# EAGLE schematic COSEQ_shield (EAGLE 6.5.0)
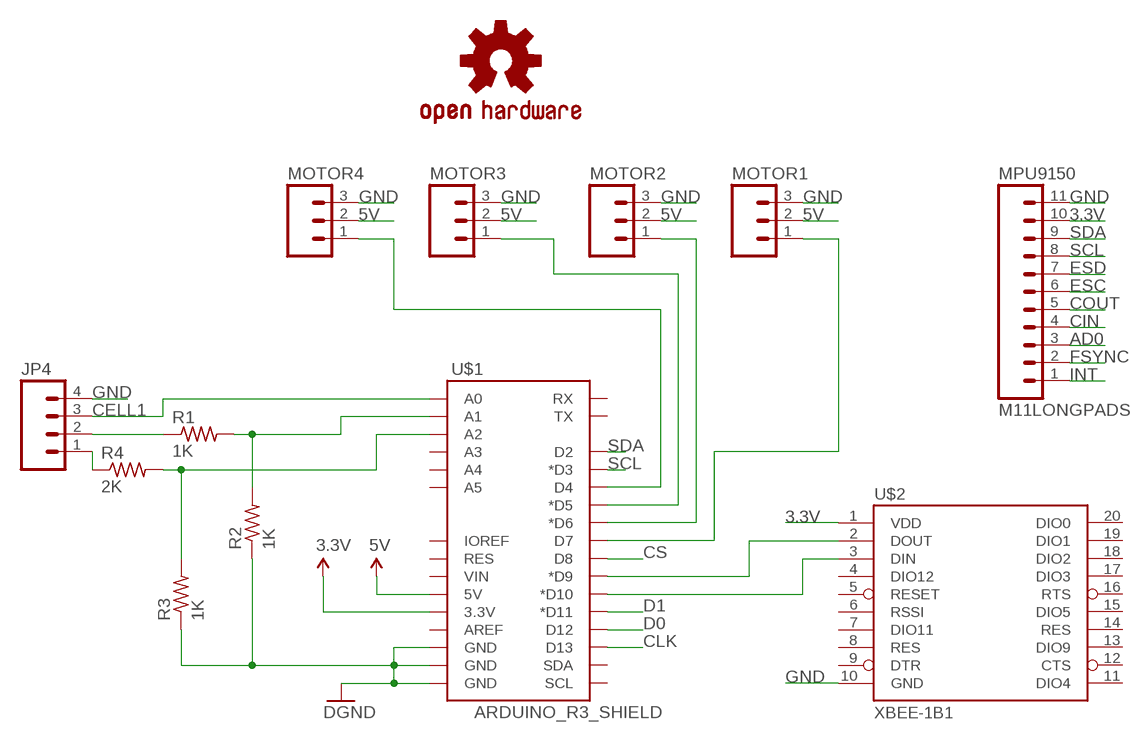
[diagram p0: schematic, sheet 1]

## Parts
JP4  M04LONGPADS  [1X04_LONGPADS]
LOGO1  OSHW-LOGOL  [OSHW-LOGO-L]
MOTOR1  M03LONGPADS  [1X03_LONGPADS]
MOTOR2  M03LONGPADS  [1X03_LONGPADS]
MOTOR3  M03LONGPADS  [1X03_LONGPADS]
MOTOR4  M03LONGPADS  [1X03_LONGPADS]
MPU9150  M11LONGPADS  [1X11_LONGPADS]
R1  1K  RESISTOR1/6WATT  [RESISTOR]
R2  1K  RESISTOR1/6WATT  [RESISTOR]
R3  1K  RESISTOR1/6WATT  [RESISTOR]
R4  2K  RESISTOR1/6WATT  [RESISTOR]
U$1  ARDUINO_R3_SHIELD  [UNO_R3_SHIELD]
U$2  XBEE-1B1  [XBEE-1]

## Nets
3.3V: MPU9150.10 U$1.3.3V U$2.1(VDD)
5V: MOTOR1.2 MOTOR2.2 MOTOR3.2 MOTOR4.2 U$1.5V
AD0: MPU9150.3
CELL1: JP4.3 U$1.A0
CIN: MPU9150.4
CLK: U$1.D13
COUT: MPU9150.5
CS: U$1.D8
D0: U$1.D12
D1: U$1.D11(*D11)
ESC: MPU9150.6
ESD: MPU9150.7
FSYNC: MPU9150.2
GND: JP4.4 MOTOR1.3 MOTOR2.3 MOTOR3.3 MOTOR4.3 MPU9150.11 R2.1 R3.1 U$1.GND@0(GND) U$1.GND@1(GND) U$1.GND@2(GND) U$2.10(GND) ; supply symbol labelled DGND
INT: MPU9150.1
M1: MOTOR4.1 U$1.D4
M2: MOTOR3.1 U$1.D5(*D5)
M3: MOTOR2.1 U$1.D6(*D6)
M4: MOTOR1.1 U$1.D7
N$1: JP4.2 R1.1
N$2: U$1.D10(*D10) U$2.3(DIN)
N$4: R1.2 R2.2 U$1.A1
N$5: U$1.D9(*D9) U$2.2(DOUT)
N$6: JP4.1 R4.1
N$7: R3.2 R4.2 U$1.A2
SCL: MPU9150.8 U$1.D3(*D3)
SDA: MPU9150.9 U$1.D2
Unconnected: U$1.A3 U$1.A4 U$1.A5 U$1.AREF U$1.IOREF U$1.RES U$1.RX U$1.SCL U$1.SDA U$1.TX U$1.VIN U$2.4(DIO12) U$2.5(RESET) U$2.6(RSSI) U$2.7(DIO11) U$2.8(RES) U$2.9(DTR) U$2.11(DIO4) U$2.12(CTS) U$2.13(DIO9) U$2.14(RES) U$2.15(DIO5) U$2.16(RTS) U$2.17(DIO3) U$2.18(DIO2) U$2.19(DIO1) U$2.20(DIO0)

## Library data of the parts
JP4 = SparkFun-Connectors:M04: Header 4 Standard 4-pin 0.1" header. Use with straight break away headers (SKU : PRT-00116), right angle break away headers (PRT-00553), swiss pins (PRT-00743), machine pins (PRT-00117), and female headers (PRT-00115). Molex polarized connector foot print use with SKU : PRT-08231 with associated crimp pins and housings. 1MM SMD Version SKU: PRT-10208
LOGO1 = SparkFun-Aesthetics:OSHW-LOGO: Open Source Hardware Logo This logo indicates the piece of hardware it is found on incorporates a OSHW license and/or adheres to the definition of open source hardware found here: http://freedomdefined.org/OSHW
MOTOR1-MOTOR4 = SparkFun-Connectors:M03: Header 3 Standard 3-pin 0.1" header. Use with straight break away headers (SKU : PRT-00116), right angle break away headers (PRT-00553), swiss pins (PRT-00743), machine pins (PRT-00117), and female headers (PRT-00115). Molex polarized connector foot print use with SKU : PRT-08232 with associated crimp pins and housings.
MPU9150 = SparkFun-Connectors:M11: Header 11 Standard 11-pin 0.1" header. Use with straight break away headers (SKU : PRT-00116), right angle break away headers (PRT-00553), swiss pins (PRT-00743), machine pins (PRT-00117), and female headers (PRT-00115).
R1-R4 = RBBB:RESISTOR: RESISTOR, American symbol
U$1 = SparkFun-Boards:ARDUINO_R3_SHIELD: Shield form compatible with the Arduino Uno R3.
U$2 = SparkFun-RF:XBEE-1: Xbee module footprints SMT header is CONN-09042.